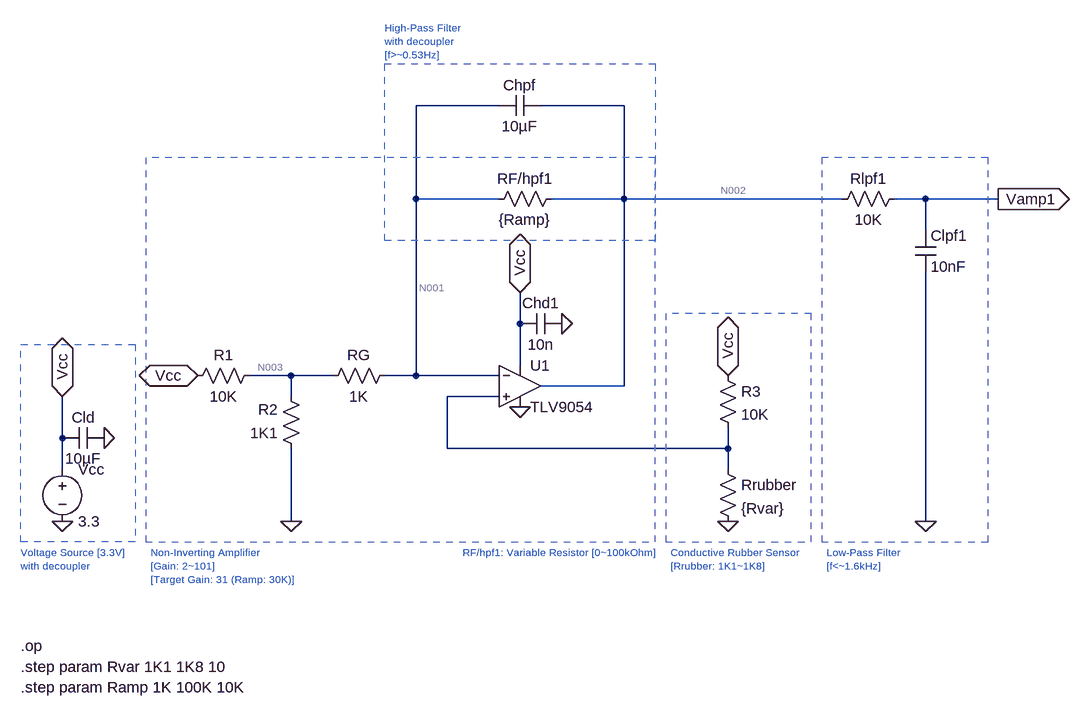
[diagram p0: schematic Project_3_RubberSensor.asc]
* Project_3_RubberSensor.asc
* U1: TLV9054 (symbol TLV9054 not available, pins judged from their places): In+=N004 In-=N001 V+=Vcc V-=0 OUT=N002
Vcc Vcc 0 3.3
RF/hpf1 N002 N001 {Ramp}
Cld 0 Vcc 10µF
Chd1 0 Vcc 10n
RG N001 N003 1K
R1 N003 Vcc 10K
R2 0 N003 1K1
Clpf1 Vamp1 0 10nF
Rlpf1 Vamp1 N002 10K
Chpf N002 N001 10µF
R3 Vcc N004 10K
Rrubber N004 0 {Rvar}
* Voltage Source [3.3V]
* with decoupler
.op
* Non-Inverting Amplifier
* [Gain: 2~101]
* [Target Gain: 31 (Ramp: 30K)]
* Conductive Rubber Sensor
* [Rrubber: 1K1~1K8]
* Low-Pass Filter
* [f<~1.6kHz]
* High-Pass Filter
* with decoupler
* [f>~0.53Hz]
* RF/hpf1: Variable Resistor [0~100kOhm]
.step param Rvar 1K1 1K8 10
.step param Ramp 1K 100K 10K
.backanno
.end

* Results of the author's LTspice run, read from the files saved beside the schematic
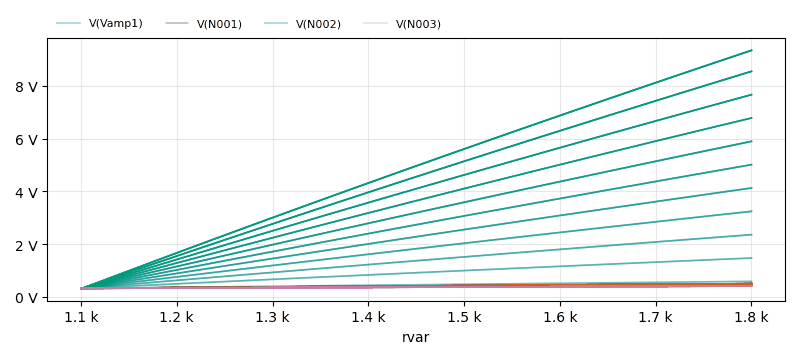
[diagram p1: Operating Point of Project_3_RubberSensor.asc, plotted from the saved traces]
* Operating Point, 11 runs:
*   V(Vamp1) [run 1]: 326.5 mV at rvar=1.1 k, 591.5 mV at rvar=1.8 k, min 326.5 mV, max 591.5 mV
*   V(Vamp1) [run 2]: 324.9 mV at rvar=1.1 k, 1.476 V at rvar=1.8 k, min 324.9 mV, max 1.476 V
*   V(Vamp1) [run 3]: 323.2 mV at rvar=1.1 k, 2.359 V at rvar=1.8 k, min 323.2 mV, max 2.359 V
*   V(Vamp1) [run 4]: 321.5 mV at rvar=1.1 k, 3.243 V at rvar=1.8 k, min 321.5 mV, max 3.243 V
*   V(Vamp1) [run 5]: 319.8 mV at rvar=1.1 k, 4.127 V at rvar=1.8 k, min 319.8 mV, max 4.127 V
*   V(Vamp1) [run 6]: 318.2 mV at rvar=1.1 k, 5.011 V at rvar=1.8 k, min 318.2 mV, max 5.011 V
*   V(Vamp1) [run 7]: 316.5 mV at rvar=1.1 k, 5.894 V at rvar=1.8 k, min 316.5 mV, max 5.894 V
*   V(Vamp1) [run 8]: 314.8 mV at rvar=1.1 k, 6.778 V at rvar=1.8 k, min 314.8 mV, max 6.778 V
*   V(N001) [run 1]: 326.7 mV at rvar=1.1 k, 503.1 mV at rvar=1.8 k, min 326.7 mV, max 503.1 mV
*   V(N001) [run 2]: 326.7 mV at rvar=1.1 k, 503 mV at rvar=1.8 k, min 326.7 mV, max 503 mV
*   V(N001) [run 3]: 326.7 mV at rvar=1.1 k, 503 mV at rvar=1.8 k, min 326.7 mV, max 503 mV
*   V(N001) [run 4]: 326.7 mV at rvar=1.1 k, 503 mV at rvar=1.8 k, min 326.7 mV, max 503 mV
*   V(N001) [run 5]: 326.7 mV at rvar=1.1 k, 503 mV at rvar=1.8 k, min 326.7 mV, max 503 mV
*   V(N001) [run 6]: 326.7 mV at rvar=1.1 k, 503 mV at rvar=1.8 k, min 326.7 mV, max 503 mV
*   V(N001) [run 7]: 326.7 mV at rvar=1.1 k, 503 mV at rvar=1.8 k, min 326.7 mV, max 503 mV
*   V(N001) [run 8]: 326.7 mV at rvar=1.1 k, 503 mV at rvar=1.8 k, min 326.7 mV, max 503 mV
*   V(N002) [run 1]: 326.5 mV at rvar=1.1 k, 591.5 mV at rvar=1.8 k, min 326.5 mV, max 591.5 mV
*   V(N002) [run 2]: 324.9 mV at rvar=1.1 k, 1.476 V at rvar=1.8 k, min 324.9 mV, max 1.476 V
*   V(N002) [run 3]: 323.2 mV at rvar=1.1 k, 2.359 V at rvar=1.8 k, min 323.2 mV, max 2.359 V
*   V(N002) [run 4]: 321.5 mV at rvar=1.1 k, 3.243 V at rvar=1.8 k, min 321.5 mV, max 3.243 V
*   V(N002) [run 5]: 319.8 mV at rvar=1.1 k, 4.127 V at rvar=1.8 k, min 319.8 mV, max 4.127 V
*   V(N002) [run 6]: 318.2 mV at rvar=1.1 k, 5.011 V at rvar=1.8 k, min 318.2 mV, max 5.011 V
*   V(N002) [run 7]: 316.5 mV at rvar=1.1 k, 5.894 V at rvar=1.8 k, min 316.5 mV, max 5.894 V
*   V(N002) [run 8]: 314.8 mV at rvar=1.1 k, 6.778 V at rvar=1.8 k, min 314.8 mV, max 6.778 V
*   V(N003) [run 1]: 326.9 mV at rvar=1.1 k, 414.6 mV at rvar=1.8 k, min 326.9 mV, max 414.6 mV
*   V(N003) [run 2]: 326.9 mV at rvar=1.1 k, 414.6 mV at rvar=1.8 k, min 326.9 mV, max 414.6 mV
*   V(N003) [run 3]: 326.9 mV at rvar=1.1 k, 414.6 mV at rvar=1.8 k, min 326.9 mV, max 414.6 mV
*   V(N003) [run 4]: 326.9 mV at rvar=1.1 k, 414.6 mV at rvar=1.8 k, min 326.9 mV, max 414.6 mV
*   V(N003) [run 5]: 326.9 mV at rvar=1.1 k, 414.6 mV at rvar=1.8 k, min 326.9 mV, max 414.6 mV
*   V(N003) [run 6]: 326.9 mV at rvar=1.1 k, 414.6 mV at rvar=1.8 k, min 326.9 mV, max 414.6 mV
*   V(N003) [run 7]: 326.9 mV at rvar=1.1 k, 414.6 mV at rvar=1.8 k, min 326.9 mV, max 414.6 mV
*   V(N003) [run 8]: 326.9 mV at rvar=1.1 k, 414.6 mV at rvar=1.8 k, min 326.9 mV, max 414.6 mV